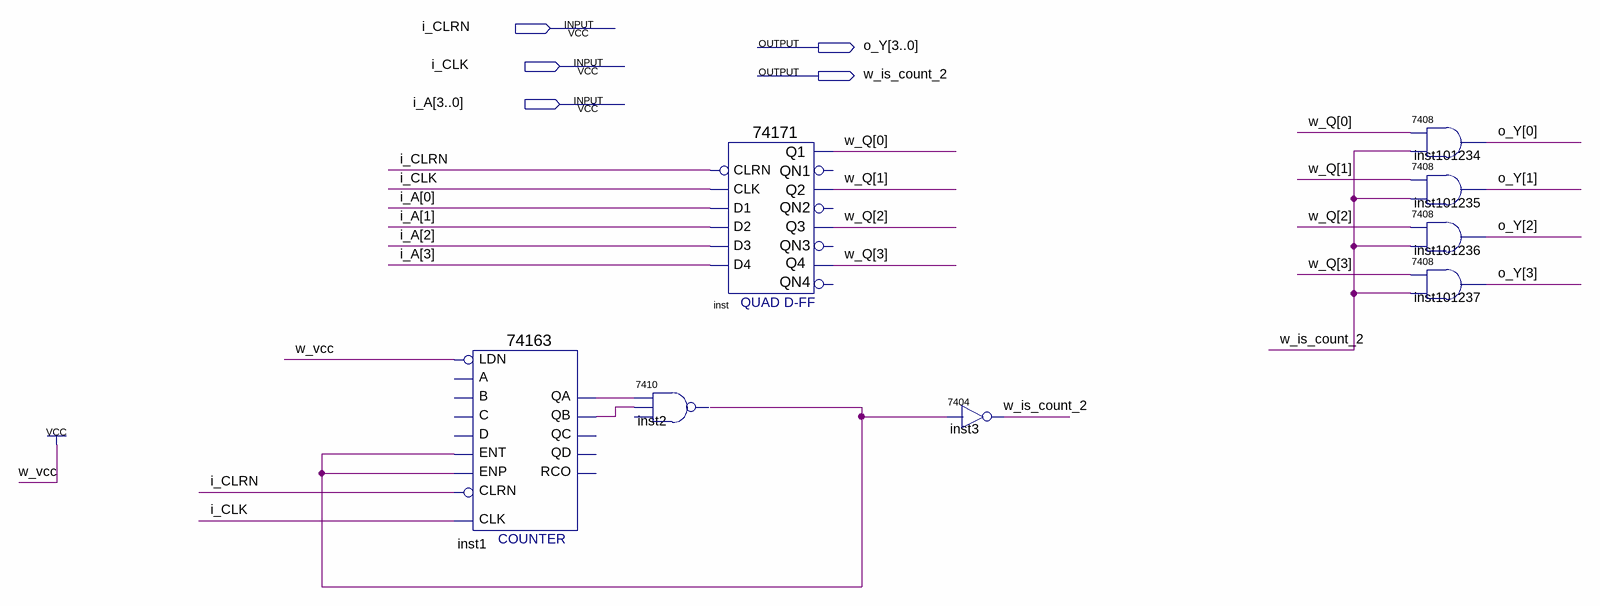
[diagram p0: schematic sheet]
// Quartus schematic quad_dff_skip.bdf as structural Verilog: 8 symbols, 5 pins
module quad_dff_skip (
  input  i_CLRN,
  input  i_CLK,
  input  [3:0] i_A,
  output [3:0] o_Y,
  output w_is_count_2
);

  wire inst1_qa, inst1_qb, inst2_1;
  wire [3:0] w_Q;

  \74163  inst1 (
    .ENT(inst2_1), .CLRN(i_CLRN), .CLK(i_CLK), .ENP(inst2_1), .LDN(1'b1), .QA(inst1_qa), .QB(inst1_qb));  // open: C, B, A, D, QC, QD, RCO
  \7410  inst2 (.\2 (inst1_qa), .\3 (inst1_qb), .\1 (inst2_1));  // open: 4
  \74171  inst (
    .CLRN(i_CLRN), .D1(i_A[0]), .CLK(i_CLK), .D2(i_A[1]), .D4(i_A[3]), .D3(i_A[2]), .Q3(w_Q[2]), .Q4(w_Q[3]),
    .Q2(w_Q[1]), .Q1(w_Q[0]));  // open: QN4, QN3, QN1, QN2
  \7404  inst3 (.\2 (inst2_1), .\1 (w_is_count_2));
  \7408  inst101234 (.\3 (w_is_count_2), .\2 (w_Q[0]), .\1 (o_Y[0]));
  \7408  inst101235 (.\3 (w_is_count_2), .\2 (w_Q[1]), .\1 (o_Y[1]));
  \7408  inst101236 (.\3 (w_is_count_2), .\2 (w_Q[2]), .\1 (o_Y[2]));
  \7408  inst101237 (.\3 (w_is_count_2), .\2 (w_Q[3]), .\1 (o_Y[3]));
endmodule
